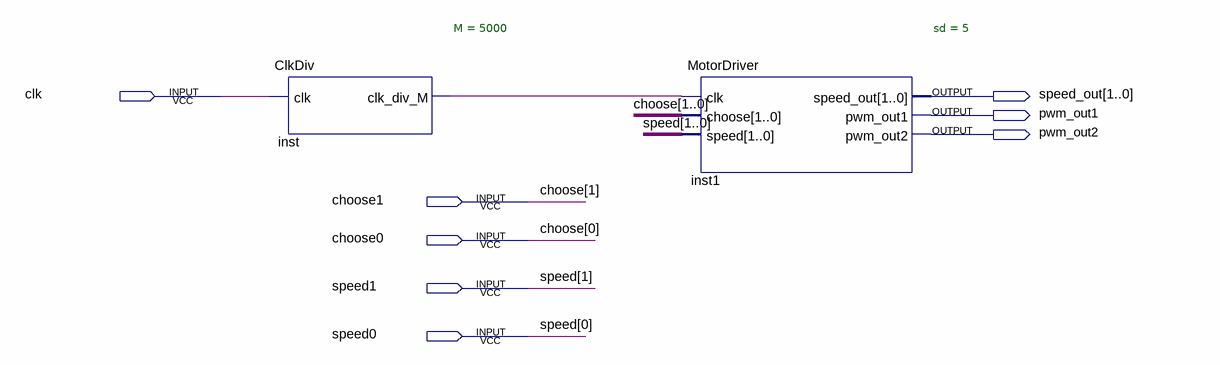
[diagram p0: schematic sheet]
// Quartus schematic MotorTest.bdf as structural Verilog: 2 symbols, 8 pins
module MotorTest (
  input  clk,
  input  choose1,
  input  choose0,
  input  speed1,
  input  speed0,
  output [1:0] speed_out,
  output pwm_out1,
  output pwm_out2
);

  wire inst_clk_div_m;

  ClkDiv #(.M(5000)) inst (.clk(clk), .clk_div_M(inst_clk_div_m));
  MotorDriver #(.sd(5)) inst1 (
    .clk(inst_clk_div_m), .choose({choose1, choose0}), .speed({speed1, speed0}), .speed_out(speed_out),
    .pwm_out1(pwm_out1), .pwm_out2(pwm_out2));
endmodule
